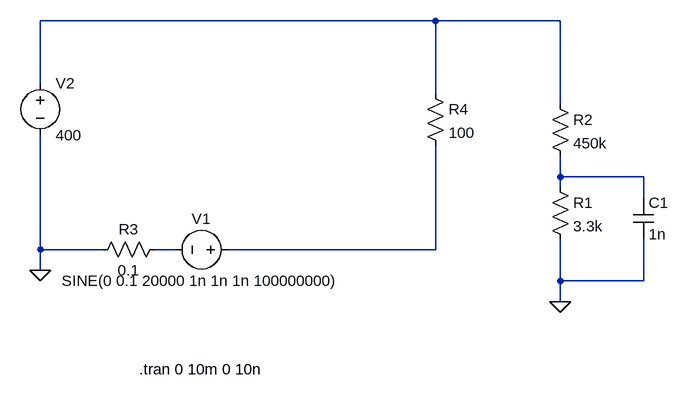
[diagram p0: schematic Draft1.asc]
Draft1.asc, the LTspice schematic file:
Version 4.1
SHEET 1 880 680
WIRE 464 -176 -144 -176
WIRE 656 -176 464 -176
WIRE -144 -80 -144 -176
WIRE 464 -64 464 -176
WIRE 656 -48 656 -176
WIRE 656 64 656 32
WIRE 784 64 656 64
WIRE 656 80 656 64
WIRE 784 96 784 64
WIRE -144 176 -144 0
WIRE -48 176 -144 176
WIRE 64 176 32 176
WIRE 464 176 464 16
WIRE 464 176 144 176
WIRE -144 208 -144 176
WIRE 656 224 656 160
WIRE 784 224 784 160
WIRE 784 224 656 224
WIRE 656 256 656 224
FLAG -144 208 0
FLAG 656 256 0
SYMBOL res 640 64 R0
SYMATTR InstName R1
SYMATTR Value 3.3k
SYMBOL res 640 -64 R0
SYMATTR InstName R2
SYMATTR Value 450k
SYMBOL voltage -144 -96 R0
WINDOW 123 0 0 Left 0
WINDOW 39 0 0 Left 0
SYMATTR InstName V2
SYMATTR Value 400
SYMBOL res 448 -80 R0
SYMATTR InstName R4
SYMATTR Value 100
SYMBOL res 48 160 R90
WINDOW 0 0 56 VBottom 2
WINDOW 3 32 56 VTop 2
SYMATTR InstName R3
SYMATTR Value 0.1
SYMBOL voltage 160 176 R90
WINDOW 0 -32 56 VBottom 2
WINDOW 3 32 56 VTop 2
WINDOW 123 0 0 Left 0
WINDOW 39 0 0 Left 0
SYMATTR InstName V1
SYMATTR Value SINE(0 0.1 20000 1n 1n 1n 100000000)
SYMBOL cap 768 96 R0
SYMATTR InstName C1
SYMATTR Value 1n
TEXT 8 360 Left 2 !.tran 0 10m 0 10n

The netlist it stands for:
* Draft1.asc
R1 N002 0 3.3k
R2 N001 N002 450k
V2 N001 0 400
R4 N001 N004 100
R3 N003 0 0.1
V1 N004 N003 SINE(0 0.1 20000 1n 1n 1n 100000000)
C1 N002 0 1n
.tran 0 10m 0 10n
.backanno
.end